# EAGLE design band4.0 (EAGLE 7.6.0)
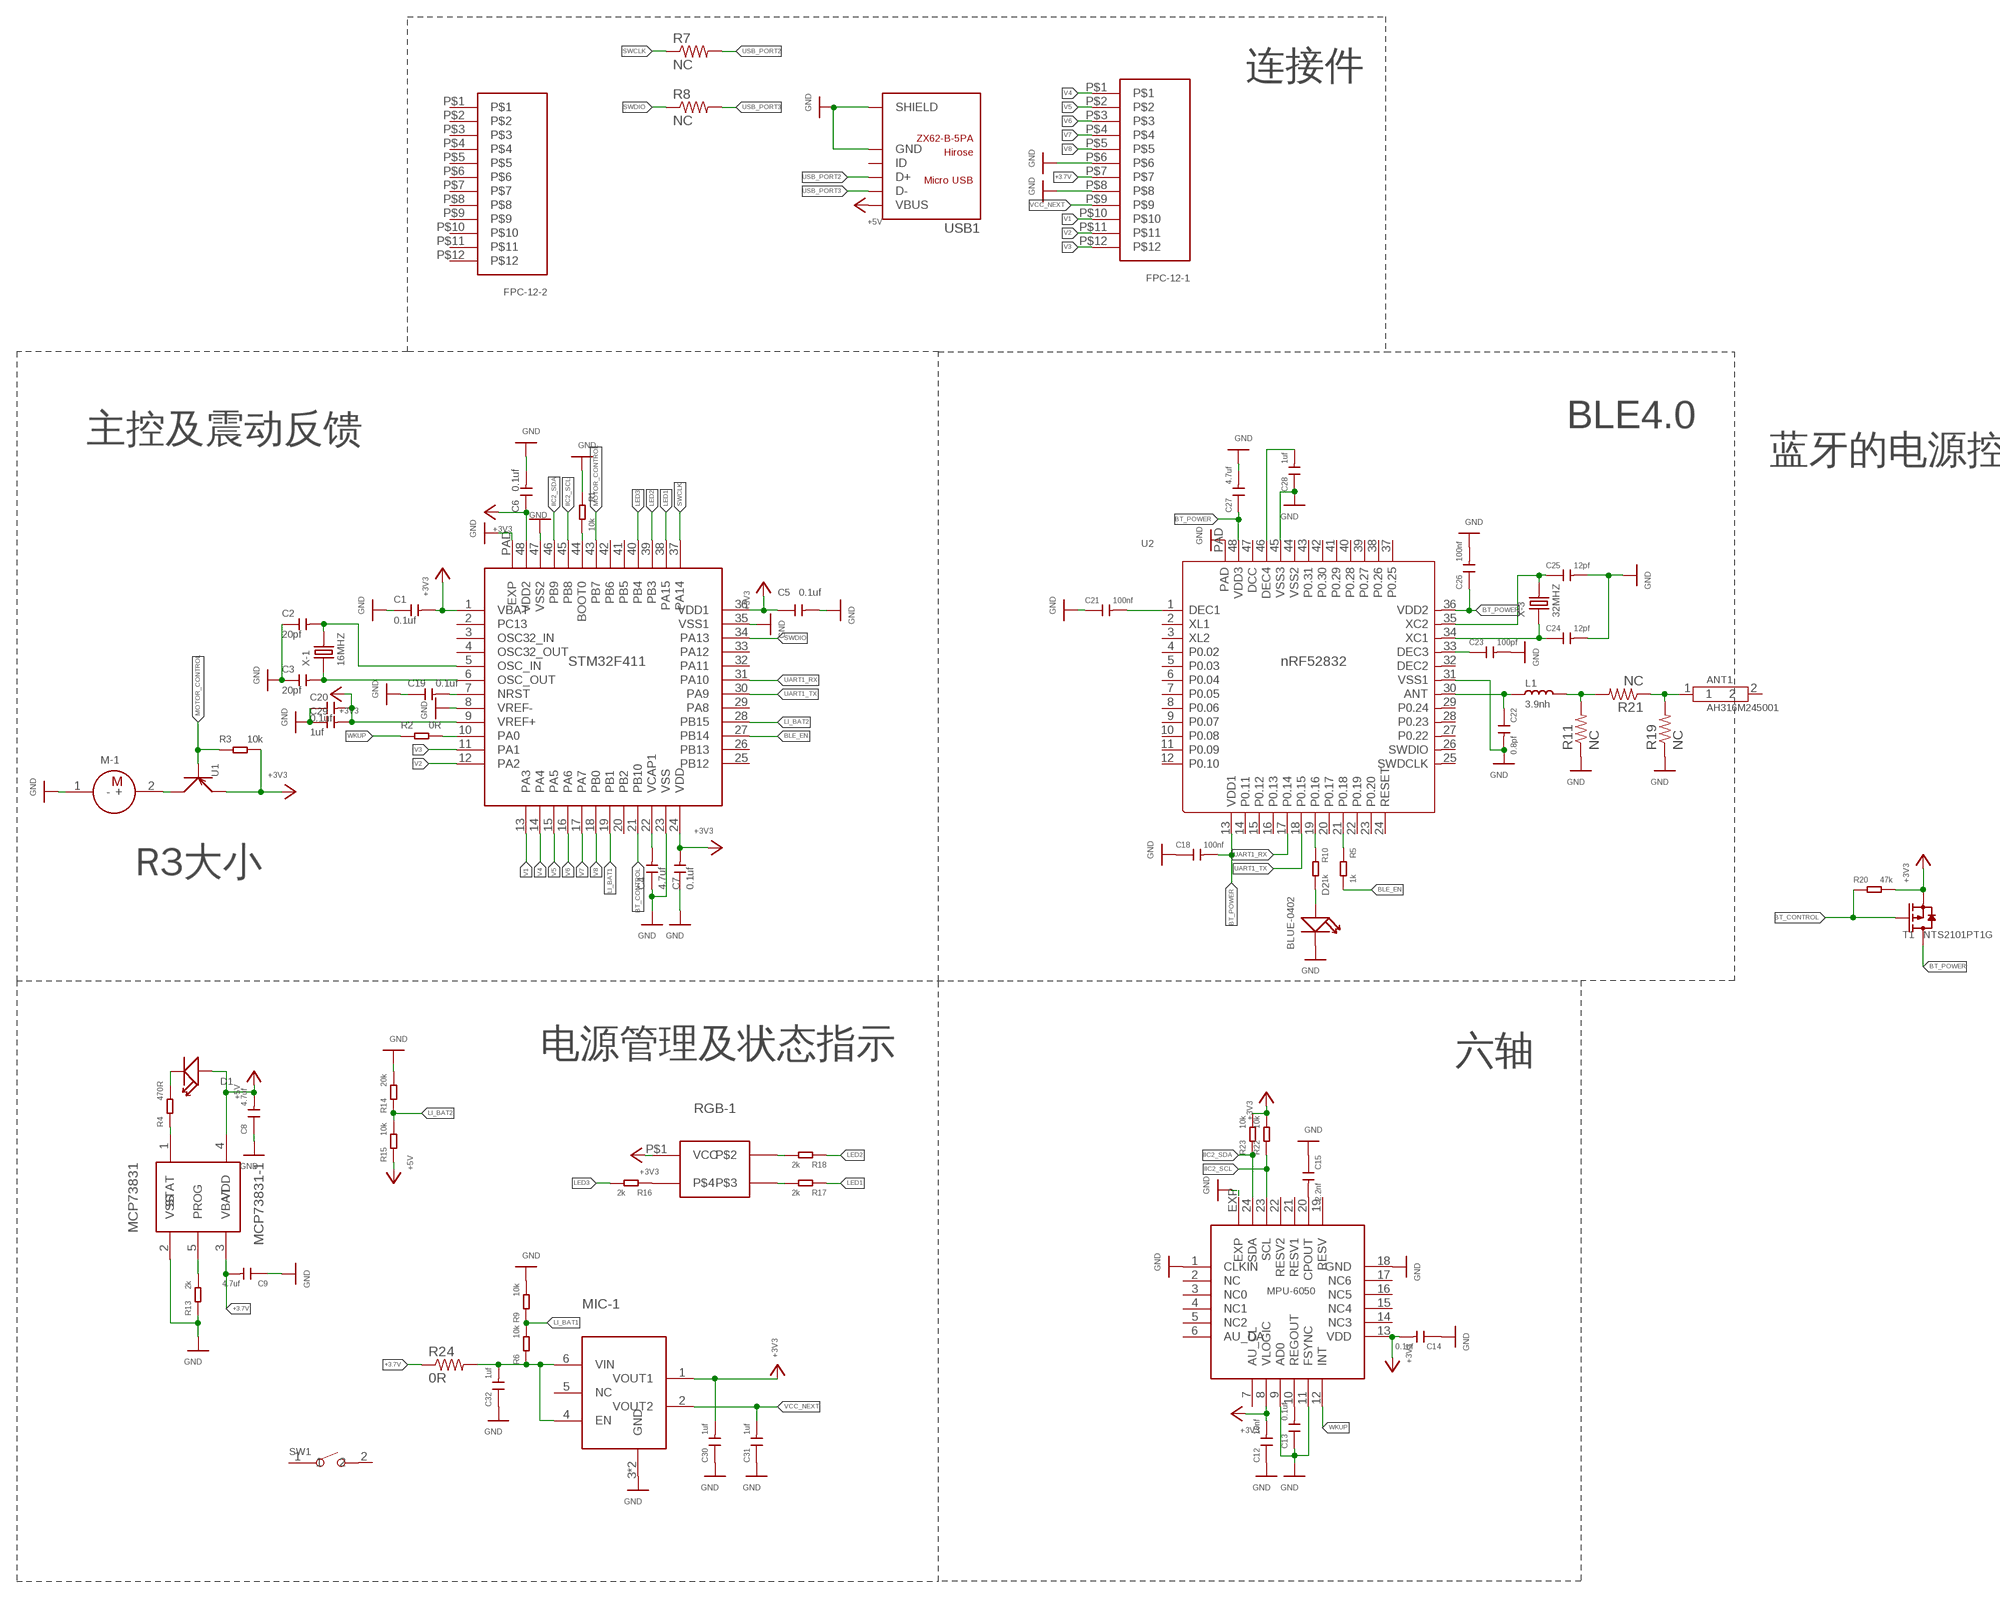
[diagram p0: schematic, sheet 1]

## Parts
ANT1  AH316M245001  ANTENNA-2.4GHZ-AH316M245001-T  [ANT2-SMD-3.2X1.6X0.5MM]
C1  0.1uf  C(0402)  [C0402]
C2  20pf  C(0402)  [C0402]
C3  20pf  C(0402)  [C0402]
C4  4.7uf  C(0402)  [C0402]
C5  0.1uf  C(0402)  [C0402]
C6  0.1uf  C(0402)  [C0402]
C7  0.1uf  C(0402)  [C0402]
C8  4.7uf  C(0402)  [C0402]
C9  4.7uf  C(0402)  [C0402]
C12  10nf  C(0402)  [C0402]
C13  0.1uf  C(0402)  [C0402]
C14  0.1uf  C(0402)  [C0402]
C15  2.2nf  C(0402)  [C0402]
C18  100nf  C(0402)  [C0402]
C19  0.1uf  C(0402)  [C0402]
C20  0.1uf  C(0402)  [C0402]
C21  100nf  C(0402)  [C0402]
C22  0.8pf  C(0402)  [C0402]
C23  100pf  C(0402)  [C0402]
C24  12pf  C(0402)  [C0402]
C25  12pf  C(0402)  [C0402]
C26  100nf  C(0402)  [C0402]
C27  4.7uf  C(0402)  [C0402]
C28  1uf  C(0402)  [C0402]
C29  1uf  C(0402)  [C0402]
C30  1uf  C(0402)  [C0402]
C31  1uf  C(0402)  [C0402]
C32  1uf  C(0402)  [C0402]
D1  LED-(0402)  [LED-0402]
D2  BLUE-0402  LED-(0402)  [LED-0402]
FPC-12-1  FPC-12  [FPC-12]
FPC-12-2  FPC-12  [FPC-12]
L1  3.9nh  INDUCTOR(0402)  [L0402]
M-1  MOTOR  [MOTOR]
MCP73831-1  MCP73831  [SOT23-5]
MCU-1  STM32F411  [QFN48G-0.5-7X7MM]
MIC-1  MIC5528  [THIN-DFN]
MPU6050-1  MPU-6050  [QFN24-4X4]
R1  10k  RES-(0402)  [R0402]
R2  0R  RES-(0402)  [R0402]
R3  10k  RES-(0402)  [R0402]
R4  470R  RES-(0402)  [R0402]
R5  1k  RES-(0402)  [R0402]
R6  10k  RES-(0402)  [R0402]
R7  NC  R_0201  [0201]
R8  NC  R_0201  [0201]
R9  10k  RES-(0402)  [R0402]
R10  1k  RES-(0402)  [R0402]
R11  NC  R_0201  [0201]
R13  2k  RES-(0402)  [R0402]
R14  20k  RES-(0402)  [R0402]
R15  10k  RES-(0402)  [R0402]
R16  2k  RES-(0402)  [R0402]
R17  2k  RES-(0402)  [R0402]
R18  2k  RES-(0402)  [R0402]
R19  NC  R_0201  [0201]
R20  47k  RES-(0402)  [R0402]
R21  NC  R_0201  [0201]
R22  10k  RES-(0402)  [R0402]
R23  10k  RES-(0402)  [R0402]
R24  0R  R_0201  [0201]
RGB-1  RGB-LED  [RGB-LED]
SW1  SMD-BUTTON(2P-6.0X3.0X2.5MM)-DHT-1163S  [SW2-4.0-6.0X3.0X2.5MM]
T1  NTS2101PT1G  [SC70]
U1  PNP  [PNP]
U2  RF-51822  IC-NRF-52832(QFN48)  [QFN48G-0.4-6X6MM]
USB1  ZX62-B-5PA  MICRO-USB-SMD(ZX62-B-5PA)  [MICRO-USB5+6P-SMD-0.65-AB]
X-1  16MHZ  [16MHZ]
X-3  32MHZ  16MHZ  [16MHZ]

## Nets
+3.7V: C9.2 FPC-12-1.P$7 MCP73831-1.3(VBAT) R24.1
+3V3: C1.2 C5.1 C6.1 C7.2 C12.2 C14.2 C20.2 C29.2 C30.2 MCU-1.1(VBAT) MCU-1.9(VREF+) MCU-1.24(VDD) MCU-1.36(VDD1) MCU-1.48(VDD2) MIC-1.1(VOUT1) MPU6050-1.8(VLOGIC) MPU6050-1.13(VDD) R3.2 R20.2 R22.2 R23.2 RGB-1.P$1(VCC) T1.2(S) U1.2(E)
+5V: C8.2 D1.+ MCP73831-1.4(VDD) R15.1 USB1.1(VBUS)
BLE_EN: MCU-1.27(PB14) R5.2
BT_CONTROL: MCU-1.21(PB10) R20.1 T1.1(G)
BT_POWER: C18.2 C26.1 C27.1 T1.3(D) U2.13(VDD1) U2.36(VDD2) U2.48(VDD3)
GND: C1.1 C2.1 C3.1 C4.1 C5.2 C6.2 C7.1 C8.1 C9.1 C12.1 C13.1 C14.1 C15.1 C18.1 C19.1 C20.1 C21.1 C22.2 C23.2 C24.2 C25.2 C26.2 C27.2 C28.1 C29.1 C30.1 C31.1 C32.1 D2.- FPC-12-1.P$6 FPC-12-1.P$8 M-1.1(-) MCP73831-1.2(VSS) MCU-1.8(VREF-) MCU-1.23(VSS) MCU-1.35(VSS1) MCU-1.47(VSS2) MCU-1.PAD(EXP) MIC-1.3(GND) MIC-1.7(GND) MPU6050-1.1(CLKIN) MPU6050-1.9(AD0) MPU6050-1.11(FSYNC) MPU6050-1.18(GND) MPU6050-1.EXP R1.1 R9.2 R11.1 R13.1 R14.2 R19.1 U2.31(VSS1) U2.45(VSS3) U2.PAD USB1.5(GND) USB1.P1(SHIELD) USB1.P2(SHIELD) USB1.P3(SHIELD) USB1.P4(SHIELD) USB1.P5(SHIELD) USB1.P6(SHIELD)
IIC2_SCL: MCU-1.45(PB8) MPU6050-1.23(SCL) R22.1
IIC2_SDA: MCU-1.46(PB9) MPU6050-1.24(SDA) R23.1
LED1: MCU-1.38(PA15) R17.1
LED2: MCU-1.39(PB3) R18.1
LED3: MCU-1.40(PB4) R16.2
LI_BAT1: MCU-1.19(PB1) R6.2 R9.1
LI_BAT2: MCU-1.28(PB15) R14.1 R15.2
MOTOR_CONTROL: MCU-1.43(PB7) R3.1 U1.1(B)
N$1: C2.2 MCU-1.5(OSC_IN) X-1.3
N$2: C3.2 MCU-1.6(OSC_OUT) X-1.1
N$3: C19.2 MCU-1.7(NRST)
N$4: MCU-1.10(PA0) R2.2
N$5: MCP73831-1.1(STAT) R4.1
N$6: D1.- R4.2
N$7: MCP73831-1.5(PROG) R13.2
N$8: R16.1 RGB-1.P$4
N$9: R17.2 RGB-1.P$3
N$10: R18.2 RGB-1.P$2
N$11: C21.2 U2.1(DEC1)
N$12: C13.2 MPU6050-1.10(REGOUT)
N$13: R10.1 U2.19(P0.16)
N$14: L1.2 R11.2 R21.2
N$15: C15.2 MPU6050-1.20(CPOUT)
N$16: ANT1.1 R19.2 R21.1
N$19: D2.+ R10.2
N$20: R5.1 U2.21(P0.18)
N$23: MCU-1.44(BOOT0) R1.2
N$24: C28.2 U2.46(DEC4)
N$26: C32.2 MIC-1.4(EN) MIC-1.6(VIN) R6.1 R24.2
N$28: C4.2 MCU-1.22(VCAP1)
N$29: M-1.2(+) U1.3(C)
N$31: C22.1 L1.1 U2.30(ANT)
N$32: C23.1 U2.33(DEC3)
N$33: C24.1 U2.34(XC1) X-3.1
N$34: C25.1 U2.35(XC2) X-3.3
SWCLK: MCU-1.37(PA14) R7.1
SWDIO: MCU-1.34(PA13) R8.1
UART1_RX: MCU-1.31(PA10) U2.17(P0.14)
UART1_TX: MCU-1.30(PA9) U2.18(P0.15)
USB_PORT2: R7.2 USB1.3(D+)
USB_PORT3: R8.2 USB1.2(D-)
V1: FPC-12-1.P$10 MCU-1.13(PA3)
V2: FPC-12-1.P$11 MCU-1.12(PA2)
V3: FPC-12-1.P$12 MCU-1.11(PA1)
V4: FPC-12-1.P$1 MCU-1.14(PA4)
V5: FPC-12-1.P$2 MCU-1.15(PA5)
V6: FPC-12-1.P$3 MCU-1.16(PA6)
V7: FPC-12-1.P$4 MCU-1.17(PA7)
V8: FPC-12-1.P$5 MCU-1.18(PB0)
VCC_NEXT: C31.2 FPC-12-1.P$9 MIC-1.2(VOUT2)
WKUP: MPU6050-1.12(INT) R2.1
Unconnected: ANT1.2 FPC-12-2.P$1 FPC-12-2.P$2 FPC-12-2.P$3 FPC-12-2.P$4 FPC-12-2.P$5 FPC-12-2.P$6 FPC-12-2.P$7 FPC-12-2.P$8 FPC-12-2.P$9 FPC-12-2.P$10 FPC-12-2.P$11 FPC-12-2.P$12 MCU-1.2(PC13) MCU-1.3(OSC32_IN) MCU-1.4(OSC32_OUT) MCU-1.20(PB2) MCU-1.25(PB12) MCU-1.26(PB13) MCU-1.29(PA8) MCU-1.32(PA11) MCU-1.33(PA12) MCU-1.41(PB5) MCU-1.42(PB6) MIC-1.5(NC) MPU6050-1.2(NC) MPU6050-1.3(NC0) MPU6050-1.4(NC1) MPU6050-1.5(NC2) MPU6050-1.6(AU_DA) MPU6050-1.7(AU_CL) MPU6050-1.14(NC3) MPU6050-1.15(NC4) MPU6050-1.16(NC5) MPU6050-1.17(NC6) MPU6050-1.19(RESV) MPU6050-1.21(RESV1) MPU6050-1.22(RESV2) SW1.1 SW1.2 U2.2(XL1) U2.3(XL2) U2.4(P0.02) U2.5(P0.03) U2.6(P0.04) U2.7(P0.05) U2.8(P0.06) U2.9(P0.07) U2.10(P0.08) U2.11(P0.09) U2.12(P0.10) U2.14(P0.11) U2.15(P0.12) U2.16(P0.13) U2.20(P0.17) U2.22(P0.19) U2.23(P0.20) U2.24(RESET) U2.25(SWDCLK) U2.26(SWDIO) U2.27(P0.22) U2.28(P0.23) U2.29(P0.24) U2.32(DEC2) U2.37(P0.25) U2.38(P0.26) U2.39(P0.27) U2.40(P0.28) U2.41(P0.29) U2.42(P0.30) U2.43(P0.31) U2.44(VSS2) U2.47(DCC) USB1.4(ID)

## Notes on the sheet
- 连接件
- BLE4.0
- 主控及震动反馈
- 蓝牙的电源控制
- R3大小
- 电源管理及状态指示 | 六轴

## Library data of the parts
ANT1 = Seeed-OPL-Antenna:ANTENNA-2.4GHZ-AH316M245001-T: 318010018; MPN: AH316M245001-T
C1-C9 C12-C15 C18-C32 = 1-BT4:C(0402): 302010048; MPN: CC0402BRNPO9BNR50; VALUE: 0.5pf
D1 = 1-BT4:LED-(0402): 304090075; MPN: BL-HB337A-AV-TRB; VALUE: BLUE-0402
D2 = 1-BT4:LED-(0402): 304090075; MPN: BL-HB337A-AV-TRB
FPC-12-1 FPC-12-2 = 1-BT4:FPC-12
L1 = 1-BT4:INDUCTOR(0402): 303010072; VALUE: 1NH-1A
M-1 = 1-BT4:MOTOR
MCP73831-1 = 1-BT4:MCP73831
MCU-1 = 1-SelfUse:STM32F411
MIC-1 = 1-intan:MIC5528
MPU6050-1 = 1-BT4:MPU-6050
R1 R3-R6 R9 R10 R13-R18 R20 R22 R23 = 1-BT4:RES-(0402): 301010000; MPN: RC0402JR-070RL; VALUE: 0R
R2 = 1-BT4:RES-(0402): 301010000; MPN: RC0402JR-070RL
R7 R8 R11 R19 R21 R24 = RHD2000_eval_board:R: Resistor
RGB-1 = 1-BT4:RGB-LED
SW1 = Seeed-OPL-Switch:SMD-BUTTON(2P-6.0X3.0X2.5MM): 311020029
T1 = 1-SelfUse:NTS2101PT1G
U1 = 1-BT4:PNP: S8550：PNP Transistor
U2 = 1-BT4:IC-NRF-52832(QFN48): 310060026; MPN: RF-51822
USB1 = 1-BT4:MICRO-USB-SMD(ZX62-B-5PA): 320010005; MPN: ZX62-B-5PA
X-1 X-3 = 1-BT4:16MHZ

## Board
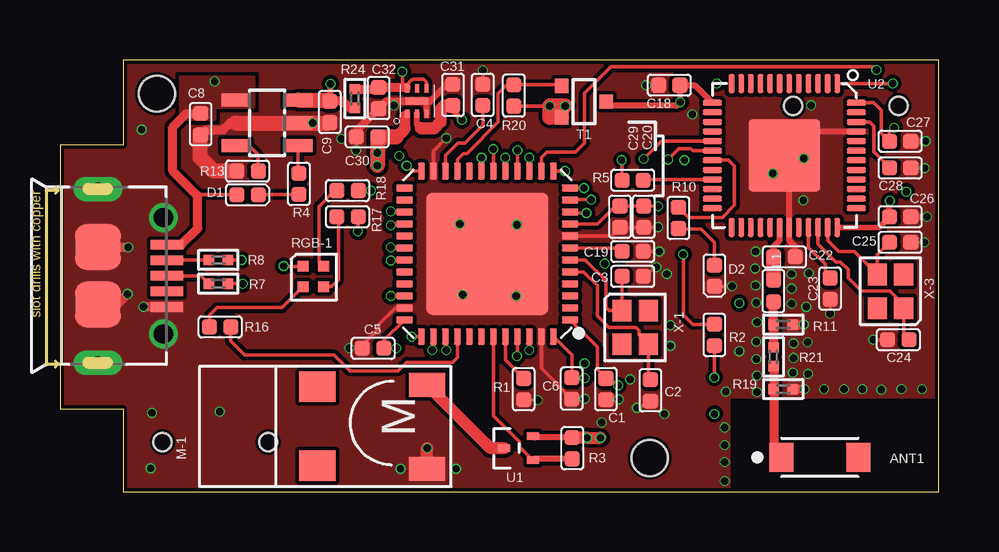
[diagram p1: board, top side]
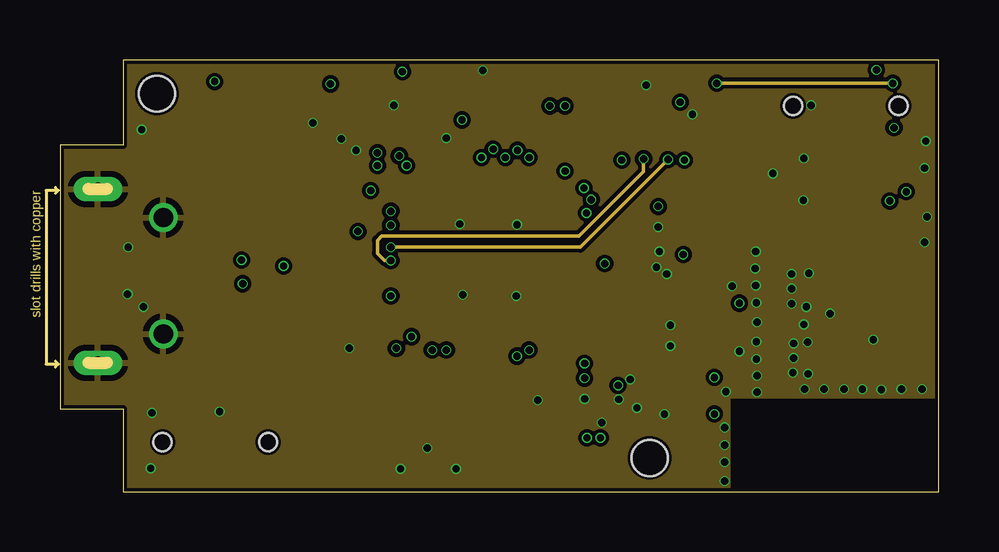
[diagram p2: board, inner layer GND]
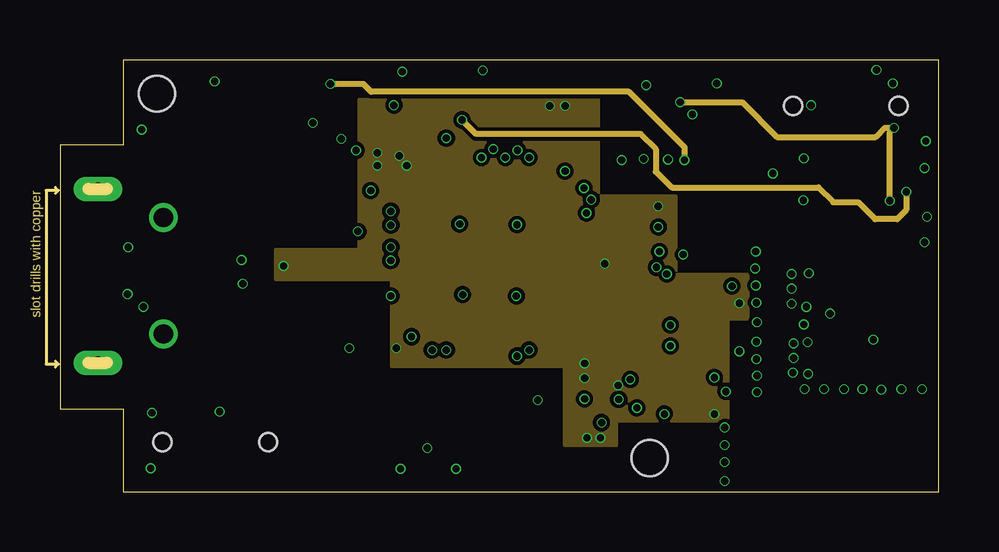
[diagram p3: board, inner layer +3V3]
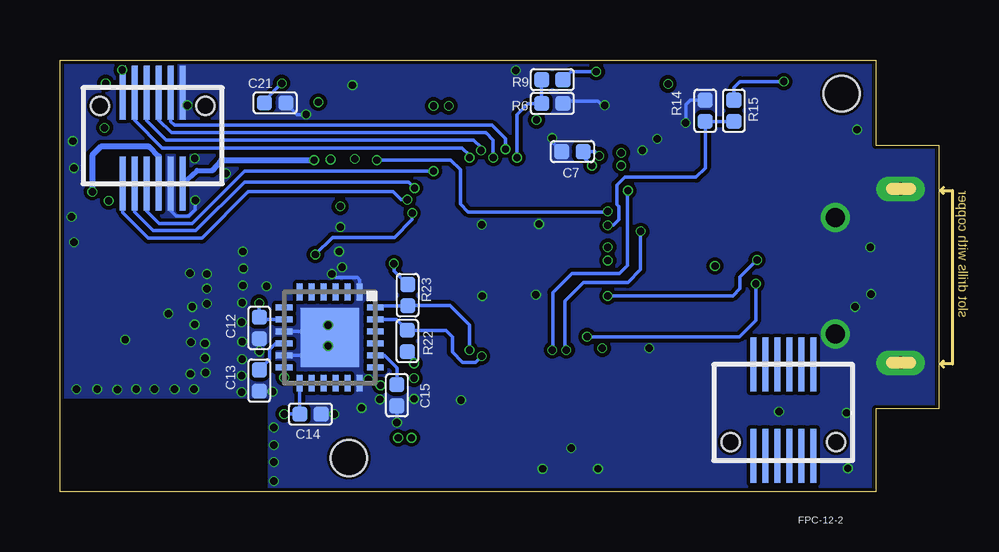
[diagram p4: board, bottom side, seen from below]

Size 36.63 x 18 mm. Coordinates in mm from the lower left corner, seen from the top.
Outline: 2.63,0 36.63,0 36.63,18 2.63,18 2.63,14.44 0,14.44 0,3.44 2.63,3.44 2.63,0
Copper layers (1*2+3*16): Top 0.035mm / dielectric 1.5mm / GND 0.035mm / dielectric 0.15mm / +3V3 0.035mm / dielectric 0.2mm / Bottom 0.035mm
Design rules "default *": minimum track width 6mil, minimum drill 12mil, track to track 6mil, track to pad 5mil, pad to pad 5mil, via to via 6mil, smd to smd 6mil, copper to edge 6mil, drill to drill 8mil, minimum pad ring 2mil, minimum via ring 2mil, stop-mask expansion 2mil, vias tented up to drill 12mil, thermal gap 10mil
Holes 1.5 mm at 24.59,1.4 4.04,16.59

### Footprints (pad centres in the part's own frame; a part is rotated, then mirrored left to right if it is on the bottom)
ANT2-SMD-3.2X1.6X0.5MM = smd 1 x 1.2: 1 -1.6,0; 2 1.6,0
C0402 = smd 0.635 x 0.635: 1 0,0.445; 2 0,-0.445
LED-0402 = smd 0.635 x 0.635: + -0.445,0; - 0.445,0
FPC-12 = smd 0.25 x 2.25: P$1 0,0; P$2 0.5,0; P$3 1,0; P$4 1.5,0; P$5 2,0; P$6 2.5,0; P$7 2.5,-3.8; P$8 2,-3.8; P$9 1.5,-3.8; P$10 1,-3.8; P$11 0.5,-3.8; P$12 0,-3.8 | hole 0.75: -0.95,-0.56; 3.45,-0.56
L0402 = smd 0.635 x 0.635: 1 -0.445,0; 2 0.445,0
MOTOR = smd 1 x 1.5: 1 -3.556,0; 2 -0.056,0 | smd 1.27 x 1.524: 3 -0.127,4.572; 4 -3.429,4.572
SOT23-5 = smd 0.55 x 1.2: 1 -0.95,-1.3; 2 0,-1.3; 3 0.95,-1.3; 4 0.95,1.3; 5 -0.95,1.3
QFN48G-0.5-7X7MM = smd 0.3 x 0.7: 1 -2.75,-3.45; 2 -2.25,-3.45; 3 -1.75,-3.45; 4 -1.25,-3.45; 5 -0.75,-3.45; 6 -0.25,-3.45; 7 0.25,-3.45; 8 0.75,-3.45; 9 1.25,-3.45; 10 1.75,-3.45; 11 2.25,-3.45; 12 2.75,-3.45; 25 2.75,3.45; 26 2.25,3.45; 27 1.75,3.45; 28 1.25,3.45; 29 0.75,3.45; 30 0.25,3.45; 31 -0.25,3.45; 32 -0.75,3.45; 33 -1.25,3.45; 34 -1.75,3.45; 35 -2.25,3.45; 36 -2.75,3.45 | smd 0.7 x 0.3: 13 3.45,-2.75; 14 3.45,-2.25; 15 3.45,-1.75; 16 3.45,-1.25; 17 3.45,-0.75; 18 3.45,-0.25; 19 3.45,0.25; 20 3.45,0.75; 21 3.45,1.25; 22 3.45,1.75; 23 3.45,2.25; 24 3.45,2.75; 37 -3.45,2.75; 38 -3.45,2.25; 39 -3.45,1.75; 40 -3.45,1.25; 41 -3.45,0.75; 42 -3.45,0.25; 43 -3.45,-0.25; 44 -3.45,-0.75; 45 -3.45,-1.25; 46 -3.45,-1.75; 47 -3.45,-2.25; 48 -3.45,-2.75 | smd 5.1 x 5.1: PAD 0,0
THIN-DFN = smd 0.18 x 0.35: 1 0.4,0.525; 2 0,0.525; 3 -0.4,0.525; 4 -0.4,-0.525; 5 0,-0.525; 6 0.4,-0.525 | smd 0.94 x 0.3: 7 0,0
QFN24-4X4 = smd 0.7 x 0.25: 1 -1.9,1.25; 2 -1.9,0.75; 3 -1.9,0.25; 4 -1.9,-0.25; 5 -1.9,-0.75; 6 -1.9,-1.25; 13 1.9,-1.25; 14 1.9,-0.75; 15 1.9,-0.25; 16 1.9,0.25; 17 1.9,0.75; 18 1.9,1.25 | smd 0.25 x 0.7: 7 -1.25,-1.9; 8 -0.75,-1.9; 9 -0.25,-1.9; 10 0.25,-1.9; 11 0.75,-1.9; 12 1.25,-1.9; 19 1.25,1.9; 20 0.75,1.9; 21 0.25,1.9; 22 -0.25,1.9; 23 -0.75,1.9; 24 -1.25,1.9 | smd 2.45 x 2.45: EXP 0,0
R0402 = smd 0.635 x 0.635: 1 0,0.445; 2 0,-0.445
0201 = smd 0.432 x 0.432: 1 -0.394,0; 2 0.394,0
RGB-LED = smd 0.45 x 0.45: P$1 0,0; P$2 0.85,0; P$3 0.85,-0.85; P$4 0,-0.85
SW2-4.0-6.0X3.0X2.5MM = smd 2.65 x 1.4: 1 -3.325,0; 2 3.325,0
SC70 = smd 0.6 x 0.55: 1 -0.65,-0.925; 2 0.65,-0.925; 3 0,0.925
PNP = smd 0.325 x 0.5: 1 -0.5,-1.2; 2 0.5,-1.2; 3 0,0
QFN48G-0.4-6X6MM = smd 0.8 x 0.25: 1 -3,2.2; 2 -3,1.8; 3 -3,1.4; 4 -3,1; 5 -3,0.6; 6 -3,0.2; 7 -3,-0.2; 8 -3,-0.6; 9 -3,-1; 10 -3,-1.4; 11 -3,-1.8; 12 -3,-2.2; 25 3,-2.2; 26 3,-1.8; 27 3,-1.4; 28 3,-1; 29 3,-0.6; 30 3,-0.2; 31 3,0.2; 32 3,0.6; 33 3,1; 34 3,1.4; 35 3,1.8; 36 3,2.2 | smd 0.25 x 0.8: 13 -2.2,-3; 14 -1.8,-3; 15 -1.4,-3; 16 -1,-3; 17 -0.6,-3; 18 -0.2,-3; 19 0.2,-3; 20 0.6,-3; 21 1,-3; 22 1.4,-3; 23 1.8,-3; 24 2.2,-3; 37 2.2,3; 38 1.8,3; 39 1.4,3; 40 1,3; 41 0.6,3; 42 0.2,3; 43 -0.2,3; 44 -0.6,3; 45 -1,3; 46 -1.4,3; 47 -1.8,3; 48 -2.2,3 | smd 3 x 3: PAD 0,0
MICRO-USB5+6P-SMD-0.65-AB = smd 0.4 x 1.35: 1 -1.3,2.875; 2 -0.65,2.875; 3 0,2.875; 4 0.65,2.875; 5 1.3,2.875 | smd 1.9 x 1.9: P1 -1.2,0; P2 1.2,0 | drill 0.508 pad 1.016 long: P3 -3.625,0; P4 3.625,0 | drill 0.8: P5 -2.425,2.73; P6 2.425,2.73
16MHZ = smd 0.9 x 0.8: 1 0,-1.1; 2 1.4,-1.1; 3 1.4,0; 4 0,0

### Placement (x,y rotation side)
ANT1  31.67,1.43 0 top
C1  22.76,4.27 180 top
C2  24.61,4.22 180 top
C3  23.88,8.97 270 top
C4  17.63,16.54 0 top
C5  13.06,5.97 270 top
C6  21.34,4.3 0 top
C7  15.26,14.18 90 bottom
C8  5.87,15.32 180 top
C9  11.25,15.83 180 top
C12  28.32,6.83 180 bottom
C13  28.32,4.63 180 bottom
C14  26.19,3.23 270 bottom
C15  22.58,4.02 180 bottom
C18  25.4,16.95 90 top
C19  23.88,10.01 270 top
C20  24.33,11.46 180 top
C21  27.66,16.21 270 bottom
C22  30.2,9.78 90 top
C23  32.11,8.46 0 top
C24  34.95,6.33 270 top
C25  35.03,10.39 90 top
C26  35.03,11.46 90 top
C27  35.03,14.61 90 top
C28  35.03,13.49 270 top
C29  23.34,11.46 180 top
C30  12.8,14.79 90 top
C31  16.38,16.54 0 top
C32  13.28,16.41 180 top
D1  7.82,12.38 0 top
D2  27.28,9 270 top
FPC-12-1  34.01,16.64 0 bottom
FPC-12-2  5.23,1.5 180 bottom
L1  29.74,8.36 270 top
M-1  15.31,4.51 90 top
MCP73831-1  8.64,15.37 90 top
MCU-1  17.81,9.91 90 top
MIC-1  14.88,16.29 180 top
MPU6050-1  25.38,6.42 270 bottom
R1  19.33,4.27 180 top
R2  27.28,6.53 180 top
R3  21.36,1.81 180 top
R4  9.96,12.83 0 top
R5  23.88,12.99 270 top
R6  16.1,17.18 270 bottom
R7  6.6,8.67 180 top
R8  6.6,9.66 180 top
R9  16.1,16.19 90 bottom
R10  25.78,11.41 0 top
R11  30.15,6.97 180 top
R13  7.82,13.37 90 top
R14  9.73,15.88 180 bottom
R15  8.53,15.88 0 bottom
R16  6.68,6.86 90 top
R17  11.99,11.46 270 top
R18  11.99,12.55 270 top
R19  30.15,4.27 180 top
R20  18.92,16.52 0 top
R21  29.74,5.62 90 top
R22  22.15,6.28 0 bottom
R23  22.13,8.19 180 bottom
R24  12.29,16.39 90 top
RGB-1  10.13,9.39 0 top
SW1  0.86,-6.5 0 top  (outside the outline)
T1  21.84,16.26 270 top
U1  18.52,1.81 90 top
U2  30.2,14.02 270 top
USB1  1.58,9 270 top
X-1  24.53,7.54 270 top
X-3  34.07,7.65 90 top

### Tracks (layer width: path | path; a pad name or v marks a point on that pad's centre or on a via)
+3.7V  (via drill 0.3 pad 0.41)
  Top 0.254: v11.28,17 11.25,16.97 C9.2
  Top 0.381: R24.1 12.08,15.99 11.79,16.29 11.26,16.29 C9.2
  Top 0.635: MCP73831-1.3 11.2,16.32 C9.2
  +3V3 0.254: v11.28,17 12.65,17 12.98,16.67 23.72,16.67 26.03,14.36 v26.03,13.82
  Bottom 0.203: FPC-12-1.P$7 30.91,13.39 30.28,13.39
  Bottom 0.254: 30.28,13.39 29.9,13.82 v26.03,13.82
+3V3  (via drill 0.3 pad 0.41)
  Top 0.152: v23.27,4.43 22.85,4.69 C1.2 22.76,4.73 22.4,5.09 22.4,6.02 MCU-1.1 | v21.87,4.73 21.88,4.74 C6.1 21.34,5.69 MCU-1.48 | v24.94,11.89 24.93,11.91 C20.2 C29.2 23.15,11.91 22.41,11.16 MCU-1.9 | v14.02,5.97 C5.1 13.5,6.3 MCU-1.36 | RGB-1.P$1 9.33,9.39 v9.32,9.4 | v14.45,13.59 14.69,13.36 MCU-1.24 | R20.2 20.42,16.07 v20.42,16.08
  Top 0.229: 14.38,15.65 MIC-1.1
  Top 0.254: R3.2 19.77,2.25 U1.2
  Top 0.457: 14.38,15.14 14.38,15.65
  Top 0.508: 14.02,14.79 14.38,15.14 | R3.2 21.96,2.25 v21.97,2.24 v22.53,2.24
  Top 0.635: v13.23,13.59 v13.23,14.13 13.25,14.14 C30.2 14.02,14.79 | T1.2 20.42,15.61 v20.42,16.08 v21.06,16.08
  Bottom 0.152: R22.2 21.87,5.56 v21.87,5.34 | R23.2 22.71,9.21 v22.71,9.51 | v28.32,7.85 C12.2 28.22,7.17 MPU6050-1.8 | v27.28,3.23 C14.2 MPU6050-1.13 | v14.15,14 14.33,14.18 C7.2 14.82,13.96 v14.45,13.59
  pour +3V3: 8.99,10.09 12.47,10.09 12.47,16.34 22.45,16.34 22.45,12.32 25.68,12.32 25.68,9.05 28.68,9.05 28.68,7.19 27.84,7.19 27.84,2.95 23.19,2.95 23.19,1.94 21.03,1.94 21.03,5.21 13.82,5.21 13.82,8.85 8.99,8.85
+5V  (via drill 0.3 pad 0.41)
  Top 0.152: D1.+ 5.79,12.38 5.74,12.32
  Top 0.381: USB1.1 5.06,10.3 5.74,10.98 5.74,12.32 4.7,13.37 4.7,15.19 5.26,15.75 5.85,15.75 C8.2
  Bottom 0.152: R15.1 8.53,16.85 8.28,17.1 v6.45,17.1
  pour Top (no thermals): 5.03,17.28 8.08,17.28 8.08,16.03 6.45,16.03 6.45,15.53 5.03,15.53
BLE_EN  (via drill 0.3 pad 0.41)
  Top 0.152: MCU-1.27 13.82,11.66 v13.79,11.69 | R5.2 23.43,13.81 v23.42,13.82
  Bottom 0.152: v23.42,13.82 20.35,13.82 19.94,13.42 19.94,11.99 19.61,11.66 13.82,11.66 v13.79,11.69
BT_CONTROL
  Top 0.152: R20.1 18.94,16.97 | MCU-1.21 16.56,13.85 16.81,14.1 16.97,14.1 18.26,15.4 18.26,16.59 18.63,16.96 R20.1 | R20.1 20.92,16.96 T1.1
BT_POWER  (via drill 0.3 pad 0.41)
  Top 0.152: U2.48 33.93,16.22 34.24,15.91 34.24,14.95 C27.1 34.58,14.98 v34.77,15.17
  Top 0.229: U2.36 34.14,11.02
  Top 0.254: 34.14,11.02 C26.1 34.58,12.11 v34.59,12.12 | U2.13 26.47,16.95 C18.2 25.84,16.25 v25.86,16.24 25.7,16.08 22.77,16.08 T1.3
  +3V3 0.254: v34.59,12.12 34.59,14.99 v34.77,15.17 34.39,15.17 34.01,14.79 29.9,14.79 28.45,16.24 v25.86,16.24
GND  (via drill 0.3 pad 0.41)
  Top 0.152: C24.2 v33.91,6.33 | C25.2 v36.04,10.39 | C23.2 v32.11,7.42 | C28.1 v36.04,13.49 | v21.87,3.87 21.91,3.85 C6.2 20.06,5.13 MCU-1.47 | R1.1 19.34,3.82 v19.91,3.82 | C3.1 v24.87,9.35 | C19.1 v24.99,10.01 | v24.94,11.03 24.93,11.02 C20.1 C29.1 22.99,10.66 MCU-1.8 | C1.1 23.28,3.83 v23.29,3.84 | C2.1 24.12,3.5 v24.05,3.49 | C4.1 v17.63,17.56 | C18.1 v24.43,16.95 | v12.06,5.97 C5.2 12.61,6.11 13.28,6.79 13.28,6.97 13.98,7.66 MCU-1.35 | 30.4,13.82 30.93,13.82 v31.01,13.9 | D2.- v28,8.55 v28.02,8.57 | v16.66,11.16 17.81,10 MCU-1.PAD | MCU-1.23 15.56,14.2 v16.1,14.74 | v12.34,14.23 12.36,14.24 12.36,15.04 | v13.92,16.11 13.92,16.29
  Top 0.229: MIC-1.3 15.28,16.29
  Top 0.254: C22.2 30.64,10.23 30.4,10.47 U2.31 30.4,13.82 U2.PAD 30.2,15.02 32.26,15.02 U2.45 | C26.2 v36.14,11.46 | C27.2 v36.09,14.61 | 15.28,16.29 MIC-1.7 | 15.42,16.29 16.12,16.99
  Top 0.305: MIC-1.7 13.92,16.29 13.6,16.29 C32.1 12.36,15.04 C30.1 | 15.28,16.29 15.42,16.29 | 16.12,16.99 C31.1
  Top 0.381: R11.1 v31.01,6.97 | R19.1 v31.04,4.27 | C8.1 6.08,15.09 6.81,15.09 7.09,15.37 7.31,15.37 | USB1.5 v3.48,7.7 | USB1.P1 v2.84,10.2 v2.84,10.19 | USB1.P2 2.38,7.8 v2.82,8.24
  Top 0.508: M-1.1 v15.31,1.8 v15.32,1.81
  Top 0.635: 7.31,15.37 MCP73831-1.2 v10.54,15.37 11.24,15.37 C9.1 | R13.1 6.4,13.37 5.84,13.92 5.84,14.85 C8.1
  Bottom 0.152: FPC-12-1.P$8 32.01,11.72 31.78,11.49 31.27,11.49 30.99,11.77 v30.99,12.15 | C15.1 v22.58,2.88 | v25.3,9.07 25.15,8.92 24.23,8.92 24.13,8.82 MPU6050-1.1 | C12.1 v28.32,5.85 | MPU6050-1.9 25.63,6.67 | 25.63,6.67 MPU6050-1.EXP 26.13,5.67 MPU6050-1.11 | C13.1 v27.76,4.17 | C14.1 v25.2,3.23 | MPU6050-1.18 23.91,4.62 v23.77,4.68 | 25.63,6.67 25.63,6.76 v25.45,6.94 | C21.1 26.73,15.73 v26.37,15.73 | R14.2 10.35,16.32 10.54,16.13 v10.54,15.37 | R9.2 15.66,16.29 14.2,16.29 13.92,16.01 v13.92,16.11 | v16.1,14.74 16.1,14.57 C7.1 | FPC-12-1.P$6 31.51,16.38 v31.32,16.11
  other vias: 14.2,0.95 16.51,0.95 29.72,13.26 25.45,6.08 16.79,8.21 19.02,8.16 19.05,11.13 11.73,14.71 30.5,9.07 30.5,8.46 30.5,7.83 31.11,7.7 31.22,9.1 30.58,6.18 30.58,5.57 30.56,4.96 31.19,4.91 31.17,6.23 29.01,10.01 28.98,9.3 29.01,8.59 29.03,7.88 29.06,7.07 29.03,6.25 29.03,5.52 29.06,4.83 29.06,4.15 27.71,2.67 27.71,1.94 27.71,1.23 27.71,0.44 31.85,4.27 32.69,4.27 33.45,4.27 34.24,4.25 35.08,4.27 35.94,4.27 3.78,0.97 3.83,3.28 3.4,15.09 6.65,3.33
  pour GND: -3.79,20.66 40.03,20.66 40.03,3.94 27.89,3.94 27.89,-3.19 -3.79,-3.19
  pour Bottom (no thermals): -3.79,20.66 40.03,20.66 40.03,3.94 27.89,3.94 27.89,-3.19 -3.79,-3.19
  pour Top (rank 2, no thermals): -3.79,20.66 40.03,20.66 40.03,3.94 27.89,3.94 27.89,-3.19 -3.79,-3.19
IIC2_SCL  (via drill 0.3 pad 0.41)
  Top 0.152: MCU-1.45 19.06,5.68 v19.05,5.64
  Bottom 0.152: v19.05,5.64 19.3,5.39 19.84,5.39 20.27,5.82 20.27,6.46 20.54,6.72 R22.1 22.6,7.17 MPU6050-1.23
IIC2_SDA  (via drill 0.3 pad 0.41)
  Top 0.152: MCU-1.46 19.56,5.98 v19.56,5.9
  Bottom 0.152: MPU6050-1.24 23.41,7.74 R23.1 20.37,7.75 19.56,6.94 v19.56,5.9
LED1  (via drill 0.3 pad 0.41)
  Top 0.152: MCU-1.38 15.56,5.88 v15.52,5.9 | R17.1 v12.43,10.86 v12.42,10.85
  Bottom 0.152: v15.52,5.9 15.57,5.95 15.57,7.96 14.81,8.72 12.95,8.72 12.42,9.25 v12.42,10.85
LED2  (via drill 0.3 pad 0.41)
  Top 0.152: R18.1 v12.95,12.55 | MCU-1.39 16.06,5.94 v16.1,5.9
  Bottom 0.152: v16.1,5.9 16.08,5.92 16.08,8.31 15.29,9.1 13.31,9.1 12.98,9.43 12.98,12.53 v12.95,12.55
LED3
  Top 0.152: R16.2 7.11,6.85 7.11,6.28 7.7,5.7 11.43,5.7 12.09,5.03 14.1,5.03 14.45,5.39 16.36,5.39 16.56,5.6 MCU-1.40
LI_BAT1  (via drill 0.3 pad 0.41)
  Top 0.152: MCU-1.19 17.56,13.96 v17.58,13.92
  Bottom 0.152: R6.2 R9.1 17.12,16.19 17.58,15.73 v17.58,13.92
LI_BAT2  (via drill 0.3 pad 0.41)
  Top 0.152: MCU-1.28 13.77,11.16 v13.79,11.11
  Bottom 0.152: R15.2 R14.1 9.73,13.49 10.11,13.11 13.08,13.11 13.41,12.78 13.41,11.97 13.33,11.89 13.33,11.33 13.56,11.11 v13.79,11.11
MOTOR_CONTROL
  Top 0.152: MCU-1.43 18.06,3.15 19.15,2.06 19.15,1.87 U1.1
  Top 0.254: R3.1 19.77,1.36 U1.1
N$1
  Top 0.152: C2.2 24.53,4.75 X-1.3 24.13,6.54 24.13,6.71 24,6.84 22.89,6.84 22.4,7.32 22.4,8.59 21.83,9.16 MCU-1.5
N$2
  Top 0.152: C3.2 X-1.1 22.89,7.55 22.76,7.68 22.76,8.79 21.89,9.66 MCU-1.6
N$3
  Top 0.152: MCU-1.7 23.28,10.16 C19.2
N$4  (via drill 0.3 pad 0.41)
  Top 0.152: R2.2 26.38,6.98 25.98,7.37 v25.98,9.89 | MCU-1.10 21.31,11.61 v21.94,11.61
  Bottom 0.152: v25.98,9.89 25.27,10.6 22.68,10.6 21.94,11.33 v21.94,11.61
N$5
  Top 0.152: MCP73831-1.1 9.94,13.3 R4.1
N$6
  Top 0.152: R4.2 8.28,12.39 D1.-
N$7
  Top 0.152: MCP73831-1.5 7.88,14.42 8.25,14.05 8.25,13.38 R13.2
N$8
  Top 0.152: R16.1 6.24,7.36 6.55,7.68 9.27,7.68 RGB-1.P$4
N$9
  Top 0.152: RGB-1.P$3 11.33,8.54 11.61,8.82 11.61,11.4 R17.2
N$10
  Top 0.152: RGB-1.P$2 10.79,9.58 10.79,11.89 11.46,12.55 R18.2
N$11  (via drill 0.3 pad 0.41)
  Top 0.152: U2.1 34.71,17.02 v34.72,17.02
  GND 0.152: v34.72,17.02 v27.38,17.02
  Bottom 0.152: v27.38,17.02 28.11,16.3 C21.2
N$12
  Bottom 0.152: MPU6050-1.10 27.64,6.17 27.89,5.92 27.89,5.5 C13.2
N$13
  Top 0.152: U2.19 27.87,13.82 28.12,13.57 28.12,11.94 27.61,11.44 26.2,11.44 R10.1
N$14
  Top 0.381: L1.2 29.74,6.97 R11.2 29.76,6.01 R21.2
N$15
  Bottom 0.152: MPU6050-1.20 23.09,5.67 22.58,5.16 C15.2
N$16
  Top 0.381: R21.1 29.76,5.23 R19.2 29.76,1.43 ANT1.1
N$19
  Top 0.152: D2.+ 27.28,10.39 26.72,10.95 25.79,10.95 R10.2
N$20
  Top 0.152: U2.21 24.35,13.02 R5.1
N$23
  Top 0.152: R1.2 18.56,5.48 MCU-1.44
N$24
  Top 0.152: U2.46 33.76,15.42 33.93,15.25 33.93,14.18 34.58,13.53 C28.2
N$26  (via drill 0.3 pad 0.41)
  Top 0.152: MIC-1.4 15.28,17.08 15.16,17.2 14.8,17.2 arc90 MIC-1.6 14.27,16.81 v14.27,17.51
  Top 0.254: 14.44,16.86 MIC-1.6
  Top 0.381: R24.2 13.21,16.78 C32.2 14.44,16.86
  Bottom 0.152: R6.1 15.33,17.51 v14.27,17.51
N$28
  Top 0.152: MCU-1.22 16.06,14.01 16.59,14.53 16.89,14.53 17.63,15.27 C4.2
N$29
  Top 0.508: U1.3 17.95,1.81 M-1.2
N$31
  Top 0.254: C22.1 29.76,10.23 30,10.47 U2.30
  Top 0.635: C22.1 29.74,9.78 L1.1
N$32
  Top 0.152: U2.33 31.2,10.18 31.9,9.48 31.9,9.11 C23.1
N$33
  Top 0.152: U2.34 31.6,10.31 32.33,9.58 32.54,9.58 32.87,9.25 32.87,8.9 33.4,8.36 34.59,8.36 35.17,7.79 X-3.1 35.17,6.55 C24.1
N$34
  Top 0.152: U2.35 32,10.47 32.46,10.01 33.11,10.01 X-3.3 34.07,9.88 C25.1
SWCLK  (via drill 0.3 pad 0.41)
  Top 0.152: R7.1 v7.62,8.67 | MCU-1.37 v14.66,6.46
  Bottom 0.152: v14.66,6.46 8.31,6.46 7.62,7.14 v7.62,8.67
SWDIO  (via drill 0.3 pad 0.41)
  Top 0.152: R8.1 v7.57,9.66 | MCU-1.34 v13.79,8.16
  Bottom 0.152: v13.79,8.16 8.59,8.16 8.28,8.46 8.28,8.95 v7.57,9.66
UART1_RX  (via drill 0.3 pad 0.41)
  Top 0.152: MCU-1.31 13.8,9.66 v13.79,9.63 | U2.17 25.07,14.62 v24.33,13.87
  GND 0.152: v24.33,13.87 24.33,13.34 21.64,10.65 13.41,10.65 13.23,10.47 13.23,9.94 13.54,9.63 v13.79,9.63
UART1_TX  (via drill 0.3 pad 0.41)
  Top 0.152: MCU-1.30 13.8,10.16 v13.79,10.19 | U2.18 26.38,14.22 26.29,14.31 25.81,14.31 v25.35,13.85
  GND 0.152: v25.35,13.85 21.69,10.19 v13.79,10.19
USB_PORT2
  Top 0.152: USB1.3 5.88,9 R7.2
USB_PORT3
  Top 0.152: USB1.2 R8.2
V1  (via drill 0.3 pad 0.41)
  Top 0.152: MCU-1.13 v21.06,13.37
  Bottom 0.152: FPC-12-1.P$10 33.01,11.71 32.49,11.18 31.11,11.18 28.93,13.37 v21.06,13.37
V2  (via drill 0.3 pad 0.41)
  Top 0.152: MCU-1.12 v21.84,12.66
  Bottom 0.152: FPC-12-1.P$11 33.51,11.65 32.74,10.88 30.96,10.88 28.93,12.91 22.1,12.91 v21.84,12.66
V3  (via drill 0.3 pad 0.41)
  Top 0.152: MCU-1.11 21.28,12.17 v22.15,12.17
  Bottom 0.152: FPC-12-1.P$12 34.01,11.64 32.94,10.57 30.71,10.57 28.78,12.5 22.73,12.5 22.4,12.17 v22.15,12.17
V4  (via drill 0.3 pad 0.41)
  Top 0.152: MCU-1.14 20.06,13.92 20.29,14.15 21.49,14.15 21.87,14.53 21.87,16.62 22.96,17.71 33.91,17.71 v34.04,17.58
  Bottom 0.152: FPC-12-1.P$1 34.01,17.56 v34.04,17.58
V5  (via drill 0.3 pad 0.41)
  Top 0.152: MCU-1.15 19.56,13.86 v19.56,13.92
  Bottom 0.152: FPC-12-1.P$2 33.51,15.48 32.36,14.33 19.86,14.33 19.56,14.03 v19.56,13.92
V6  (via drill 0.3 pad 0.41)
  Top 0.152: MCU-1.16 v19.06,14.22 v19.08,14.23
  Bottom 0.152: FPC-12-1.P$3 33.01,15.46 32.21,14.66 19.38,14.66 19.08,14.36 v19.08,14.23
V7  (via drill 0.3 pad 0.41)
  Top 0.152: MCU-1.17 v18.56,13.92 v18.57,13.92
  Bottom 0.152: FPC-12-1.P$4 32.51,15.5 31.98,14.97 18.87,14.97 18.57,14.66 v18.57,13.92
V8  (via drill 0.3 pad 0.41)
  Top 0.152: MCU-1.18 v18.06,14.28
  Bottom 0.152: FPC-12-1.P$5 32.01,15.43 31.85,15.27 18.62,15.27 18.06,14.71 v18.06,14.28
VCC_NEXT  (via drill 0.3 pad 0.41)
  Top 0.254: 15.04,15.17 14.88,15.32 MIC-1.2 | v16.76,15.5 16.38,15.88 C31.2
  Top 0.508: C31.2 16.01,16.1 15.87,15.96 15.87,15.42 15.6,15.14 15.06,15.14 15.04,15.17
  +3V3 0.254: v35.28,12.5 35.28,11.74 34.9,11.36 33.99,11.36 33.27,12.07 32.23,12.07 31.62,12.68 25.5,12.68 24.84,13.34 24.84,14.28 24.21,14.92 17.35,14.92 v16.76,15.5
  Bottom 0.229: 32.51,13.97 32.92,14.38
  Bottom 0.254: FPC-12-1.P$9 32.51,13.97 | 32.92,14.38 34.92,14.38 35.28,14.03 v35.28,12.5
WKUP  (via drill 0.3 pad 0.41)
  Top 0.152: v27.28,4.76 R2.1
  Bottom 0.152: MPU6050-1.12 v27.28,4.76 | v27.28,4.76